# Altium project Marsault1.PrjPcb (part 2 of 7)

## Sheet POWER.SchDoc
size A3; SheetNumber: 2; SheetTotal: 9
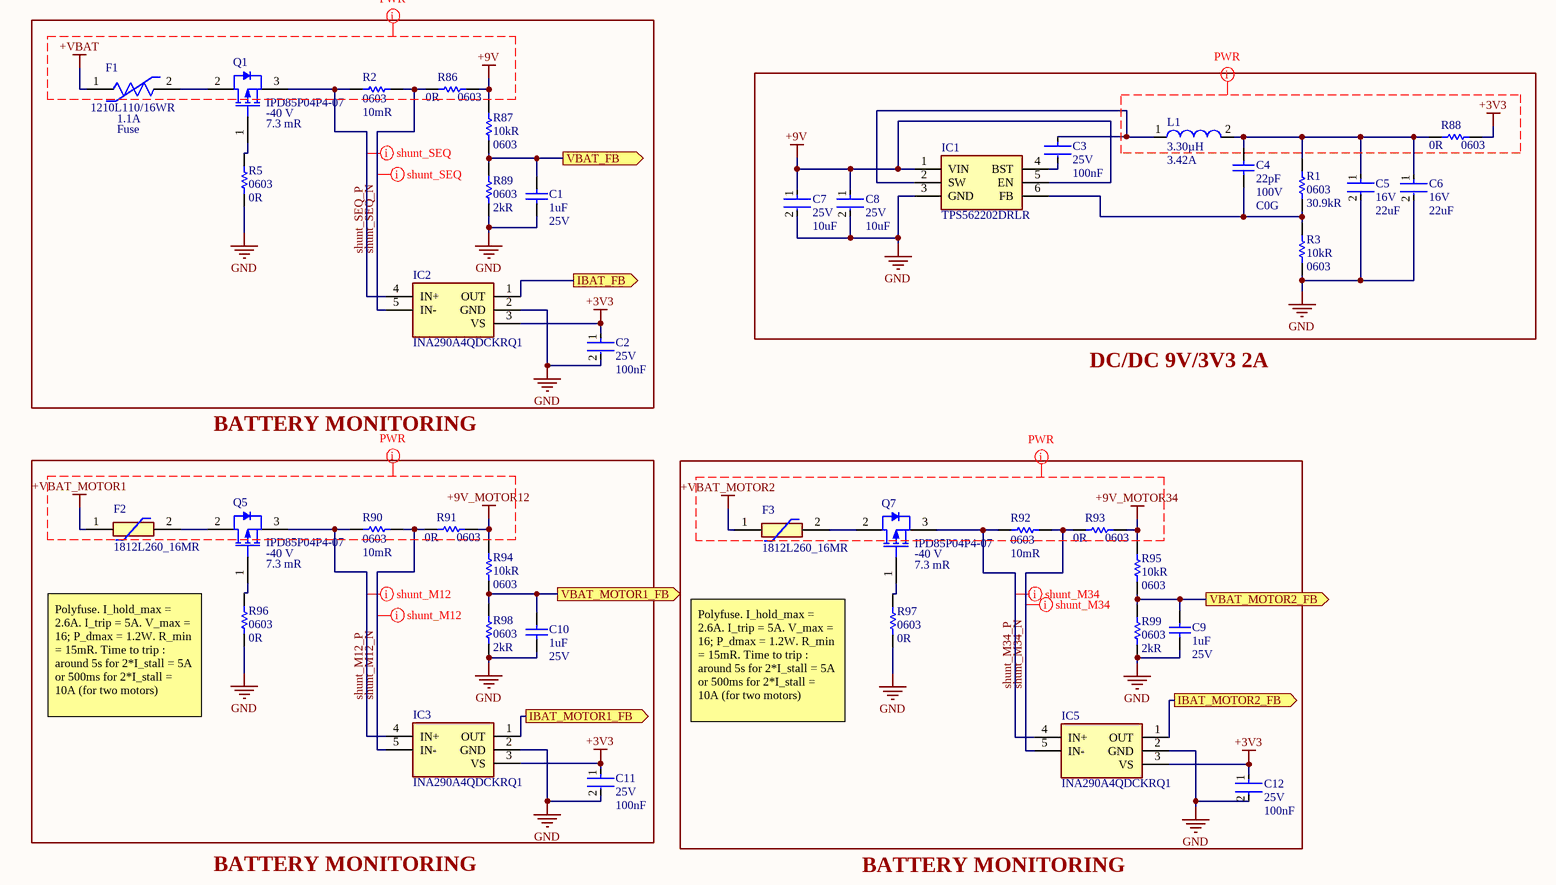
[diagram p1: POWER.SchDoc]

### Parts
C1  Capacitance: 1uF  Voltage Rating (DC): 25V  [CAPC1608X90X35LL15T15]  (hidden comment: C0603C105K3PAC7867)
C2  Voltage Rating (DC): 25V  Capacitance: 100nF  [FP-CGA3E-0_3-0_1-MFG]  (hidden comment: CGA3E2X7R1E104K080AA)
C3  Voltage Rating (DC): 25V  Capacitance: 100nF  [FP-CGA3E-0_3-0_1-MFG]  (hidden comment: CGA3E2X7R1E104K080AA)
C4  Capacitance: 22pF  Voltage Rating (DC): 100V  Dielectric: C0G  [CAPC1608X90X35NL10T15]  (hidden comment: GRM1885C2A220JA01D)
C5  Voltage Rating: 16V  Capacitance: 22uF  [FP-C2012-125-MFG]  (hidden comment: C2012X5R1C226K125AC)
C6  Voltage Rating: 16V  Capacitance: 22uF  [FP-C2012-125-MFG]  (hidden comment: C2012X5R1C226K125AC)
C7  Voltage Rating (DC): 25V  Capacitance: 10uF  [FP-C2012-125-0_2-IPC_B]  (hidden comment: C2012X5R1E106K125AB)
C8  Voltage Rating (DC): 25V  Capacitance: 10uF  [FP-C2012-125-0_2-IPC_B]  (hidden comment: C2012X5R1E106K125AB)
C9  Capacitance: 1uF  Voltage Rating (DC): 25V  [CAPC1608X90X35LL15T15]  (hidden comment: C0603C105K3PAC7867)
C10  Capacitance: 1uF  Voltage Rating (DC): 25V  [CAPC1608X90X35LL15T15]  (hidden comment: C0603C105K3PAC7867)
C11  Voltage Rating (DC): 25V  Capacitance: 100nF  [FP-CGA3E-0_3-0_1-MFG]  (hidden comment: CGA3E2X7R1E104K080AA)
C12  Voltage Rating (DC): 25V  Capacitance: 100nF  [FP-CGA3E-0_3-0_1-MFG]  (hidden comment: CGA3E2X7R1E104K080AA)
F1  1210L110/16WR  Hold Current: 1.1A  Category: Fuse  [FP-1210L110-16WR-MFG]
F2  1812L260_16MR  [1812L010DR]
F3  1812L260_16MR  [1812L010DR]
IC1  TPS562202DRLR  [SOTFL50P160X60-6N]
IC2  INA290A4QDCKRQ1  [SOT65P210X110-5N]
IC3  INA290A4QDCKRQ1  [SOT65P210X110-5N]
IC5  INA290A4QDCKRQ1  [SOT65P210X110-5N]
L1  Inductance: 3.30µH  Current Rating: 3.42A  [WE-PD-S-PB]  (hidden comment: 7447789003)
Q1  IPD85P04P4-07  VDS (max): -40 V  RDS (on) (max) (@10V): 7.3 mR  [INF-PG-TO252-3-313_L]
Q5  IPD85P04P4-07  VDS (max): -40 V  RDS (on) (max) (@10V): 7.3 mR  [INF-PG-TO252-3-313_L]
Q7  IPD85P04P4-07  VDS (max): -40 V  RDS (on) (max) (@10V): 7.3 mR  [INF-PG-TO252-3-313_L]
R1  Case Code (Imperial): 0603  Resistance: 30.9kR  [RESC1608X55X25NL10T15]  (hidden comment: RC0603FR-0730K9L)
R2  Case Code (Imperial): 0603  Resistance: 10mR  [RESC1508X46X38ML25T25]  (hidden comment: WSL0603R0100FEA)
R3  Resistance: 10kR  Case Code (Imperial): 0603  [RESC1609X55X30LL15T15]  (hidden comment: ERJ3EKF1002V)
R5  Case Code (Imperial): 0603  Resistance: 0R  [RESC1608X55X25ML10T15]  (hidden comment: RC0603JR-070RL)
R86  Case Code (Imperial): 0603  Resistance: 0R  [RESC1608X55X25ML10T15]  (hidden comment: RC0603JR-070RL)
R87  Resistance: 10kR  Case Code (Imperial): 0603  [RESC1609X55X30LL15T15]  (hidden comment: ERJ3EKF1002V)
R88  Case Code (Imperial): 0603  Resistance: 0R  [RESC1608X55X25ML10T15]  (hidden comment: RC0603JR-070RL)
R89  Case Code (Imperial): 0603  Resistance: 2kR  [RESC1608X55X30ML15T15]  (hidden comment: ERJ-3EKF2001V)
R90  Case Code (Imperial): 0603  Resistance: 10mR  [RESC1508X46X38ML25T25]  (hidden comment: WSL0603R0100FEA)
R91  Case Code (Imperial): 0603  Resistance: 0R  [RESC1608X55X25ML10T15]  (hidden comment: RC0603JR-070RL)
R92  Case Code (Imperial): 0603  Resistance: 10mR  [RESC1508X46X38ML25T25]  (hidden comment: WSL0603R0100FEA)
R93  Case Code (Imperial): 0603  Resistance: 0R  [RESC1608X55X25ML10T15]  (hidden comment: RC0603JR-070RL)
R94  Resistance: 10kR  Case Code (Imperial): 0603  [RESC1609X55X30LL15T15]  (hidden comment: ERJ3EKF1002V)
R95  Resistance: 10kR  Case Code (Imperial): 0603  [RESC1609X55X30LL15T15]  (hidden comment: ERJ3EKF1002V)
R96  Case Code (Imperial): 0603  Resistance: 0R  [RESC1608X55X25ML10T15]  (hidden comment: RC0603JR-070RL)
R97  Case Code (Imperial): 0603  Resistance: 0R  [RESC1608X55X25ML10T15]  (hidden comment: RC0603JR-070RL)
R98  Case Code (Imperial): 0603  Resistance: 2kR  [RESC1608X55X30ML15T15]  (hidden comment: ERJ-3EKF2001V)
R99  Case Code (Imperial): 0603  Resistance: 2kR  [RESC1608X55X30ML15T15]  (hidden comment: ERJ-3EKF2001V)

### Ports
IBAT_FB (out), IBAT_MOTOR1_FB (out), IBAT_MOTOR2_FB (out), VBAT_FB (out), VBAT_MOTOR1_FB (out), VBAT_MOTOR2_FB (out)

### Nets
+3V3: C2.1 C11.1 C12.1 IC2.3(VS) IC3.3(VS) IC5.3(VS) R88.2
+9V: C7.1 C8.1 IC1.1(VIN) IC1.5(EN) R86.2 R87.2
+9V_MOTOR12: R91.2 R94.2  [project net VCC_PWR]
+9V_MOTOR34: R93.2 R95.2  [project net VCC_PWR]
+VBAT: F1.1
+VBAT_MOTOR1: F2.1
+VBAT_MOTOR2: F3.1
GND: C1.1 C2.2 C5.2 C6.2 C7.2 C8.2 C9.1 C10.1 C11.2 C12.2 IC1.3(GND) IC2.2(GND) IC3.2(GND) IC5.2(GND) R3.1 R5.1 R89.1 R96.1 R97.1 R98.1 R99.1
IBAT_FB: IC2.1(OUT) ; port IBAT_FB
IBAT_MOTOR1_FB: IC3.1(OUT) ; port IBAT_MOTOR1_FB
IBAT_MOTOR2_FB: IC5.1(OUT) ; port IBAT_MOTOR2_FB
shunt_M12_N: IC3.5(IN-) R90.2 R91.1
shunt_M12_P: IC3.4(IN+) Q5.3(SOURCE) R90.1
shunt_M34_N: IC5.5(IN-) R92.2 R93.1
shunt_M34_P: IC5.4(IN+) Q7.3(SOURCE) R92.1
shunt_SEQ_N: IC2.5(IN-) R2.2 R86.1
shunt_SEQ_P: IC2.4(IN+) Q1.3(SOURCE) R2.1
VBAT_FB: C1.2 R87.1 R89.2 ; port VBAT_FB
VBAT_MOTOR1_FB: C10.2 R94.1 R98.2 ; port VBAT_MOTOR1_FB
VBAT_MOTOR2_FB: C9.2 R95.1 R99.2 ; port VBAT_MOTOR2_FB
NetC3_1: C3.1 IC1.2(SW) L1.1
NetC3_2: C3.2 IC1.4(BST)
NetC4_1: C4.1 IC1.6(FB) R1.1 R3.2
NetC4_2: C4.2 C5.1 C6.1 L1.2 R1.2 R88.1
NetF1_2: F1.2 Q1.2(DRAIN)
NetF2_2: F2.2 Q5.2(DRAIN)
NetF3_2: F3.2 Q7.2(DRAIN)
NetQ1_1: Q1.1(GATE) R5.2
NetQ5_1: Q5.1(GATE) R96.2
NetQ7_1: Q7.1(GATE) R97.2

### Layout directives
net class PWR: +3V3, +9V, +9V_MOTOR12, +9V_MOTOR34, +VBAT, +VBAT_MOTOR1, +VBAT_MOTOR2
differential pair; differential pair class shunt_M12: shunt_M12_N, shunt_M12_P
differential pair; differential pair class shunt_SEQ: shunt_SEQ_N, shunt_SEQ_P
differential pair; differential pair class shunt_M34: shunt_M34_N, shunt_M34_P

### Notes on the sheet
- DC/DC 9V/3V3 2A
- BATTERY MONITORING
- Polyfuse. I_hold_max = 2.6A. I_trip = 5A. V_max = 16; P_dmax = 1.2W. R_min = 15mR. Time to trip : around 5s for 2*I_stall = 5A or 500ms for 2*I_stall = 10A (for two motors)

### Library data of the parts
C1 C9 C10 = CMP-2006-02216-2: Manufacturer: Kemet; Manufacturer Part Number: C0603C105K3PACTU; Dielectric Material: Ceramic; Tolerance: 10%; Dielectric: X5R; Part Number: C0603C105K3PAC7867; Supplier 1: Mouser; Supplier Part Number 1: 80-C0603C105K3P; RoHS: Yes; Category: Ceramic Capacitors; Stock 1: 10085; Pricing 1: 1=0,30000, 10=0,15600, 50=0,15600, 100=0,09300, 500=0,08200, 1000=0,07300, 4000=0,05700, 10000=0,05700 (USD); Mount: Surface Mount,PCB; Case/Package: 0603; Number of Pins: 2; Case Code (Imperial): 0603; Case Code (Metric): 1608; Contact Plating: Tin,Matte; Min Operating Temperature: -55°C; Max Operating Temperature: 85°C; Packaging: Tape and Reel; Termination: SMD/SMT; Voltage Rating: 25V; Package Quantity: 4000; Voltage: 25V; Series: C0603C; Construction: Flat; Length: 1.6mm; Width: 0.031inch; Height: 0.8mm; Depth: 0.8mm; Thickness: 0.034inch; Radiation Hardening: No; REACH SVHC: No SVHC; RoHS Compliant: Yes; Lead Free: Lead Free; ComponentLink1URL: https://datasheet.ciiva.com/5998/40889-5998745.pdf?src-supplier=Farnell; ComponentLink1Description: https://datasheet.ciiva.com/5998/40889-5998745.pdf?src-supplier=Farnell; ComponentLink2URL: https://datasheet.ciiva.com/28610/1918694-28610792.pdf?src-supplier=Element14; ComponentLink2Description: https://datasheet.ciiva.com/28610/1918694-28610792.pdf?src-supplier=Element14
C2 C3 C11 C12 = CMP-08246-002186-1: Cap Ceramic 100nF 25V X7R 10% Pad SMD 0603 +125°C Automotive T/R; Manufacturer: TDK; Composition: Ceramic; Dielectric: X7R; Ratings: AEC-Q200; Length: 1.6mm; REACH SVHC: No SVHC; Width: 0.031inch; Packaging: Tape and Reel; Case/Package: 0603; Height: 0.8mm; Termination: SMD/SMT; Max Operating Temperature: 125°C; Thickness: 0.035inch; Case Code (Metric): 1608; Lead Free: Lead Free; Mount: Surface Mount; Voltage Rating: 25V; Tolerance: 10%; Weight: 7.1E-05oz; Min Operating Temperature: -55°C; Package Quantity: 1; Depth: 0.8mm; Case Code (Imperial): 0603; Supplier 1: Mouser; Supplier Part Number 1: 810-CGA3E2X7R1E104K; Manufacturer Part Number: CGA3E2X7R1E104K080AA; RoHS: Yes; Category: Ceramic Capacitors; Stock 1: 488891; Pricing 1: 1=0,12000, 10=0,05600, 50=0,05600, 100=0,02500, 1000=0,01400, 10000=0,01000 (USD); Series: CGA; Resistor Type: Ceramic; RoHS Compliant: Yes; ComponentLink1URL: https://datasheet.ciiva.com/24220/cga3e2x7r1e104k080aa-265934-24220022.pdf?src-supplier=Mouser; ComponentLink1Description: https://datasheet.ciiva.com/24220/cga3e2x7r1e104k080aa-265934-24220022.pdf?src-supplier=Mouser; ComponentLink2URL: https://datasheet.ciiva.com/22725/1735392-22725638.pdf?src-supplier=Element14; ComponentLink2Description: https://datasheet.ciiva.com/22725/1735392-22725638.pdf?src-supplier=Element14; ComponentLink3URL: https://datasheet.ciiva.com/22725/1735392-22725639.pdf?src-supplier=Element14; ComponentLink3Description: https://datasheet.ciiva.com/22725/1735392-22725639.pdf?src-supplier=Element14; ComponentLink4URL: https://datasheet.ciiva.com/16427/mlccspec-automotive-general-midvoltage-en-16427320.pdf?src-supplier=Future+Electronics; ComponentLink4Description: https://datasheet.ciiva.com/16427/mlccspec-automotive-general-midvoltage-en-16427320.pdf?src-supplier=Future+Electronics; ComponentLink5URL: https://datasheet.ciiva.com/23803/1735392-23803082.pdf?src-supplier=Newark; ComponentLink5Description: https://datasheet.ciiva.com/23803/1735392-23803082.pdf?src-supplier=Newark
C4 = CMP-2006-02720-1: Manufacturer: Murata; Material: Ceramic; Tolerance: 5%; Temperature Coefficient: 30ppm/°C; Part Number: GRM1885C2A220JA01D; Supplier 1: Mouser; Supplier Part Number 1: 81-GRM1885C2A220JA01; Manufacturer Part Number: GRM1885C2A220JA01D; RoHS: Yes; Category: Ceramic Capacitors; Stock 1: 57112; Pricing 1: 1=0,12000, 10=0,07500, 50=0,07500, 100=0,03600, 1000=0,02100, 10000=0,01600 (USD); Mount: Surface Mount; Case/Package: 0603; Case Code (Metric): 1608; Case Code (Imperial): 0603; Min Operating Temperature: -55°C; Max Operating Temperature: 125°C; Packaging: Tape and Reel; Package Quantity: 1; Voltage Rating: 100V; Series: GRM; Termination: SMD/SMT; Voltage: 100V; Construction: Flat; Length: 1.6mm; Width: 0.031inch; Height: 0.8mm; Depth: 0.8mm; Thickness: 0.035inch; Size: 0.8mm; Radiation Hardening: No; Lead Free: Lead Free; RoHS Compliant: Yes; REACH SVHC: No SVHC; ComponentLink1URL: https://datasheet.ciiva.com/16337/product-16337138.pdf?src-supplier=Future+Electronics; ComponentLink1Description: https://datasheet.ciiva.com/16337/product-16337138.pdf?src-supplier=Future+Electronics; ComponentLink2URL: https://datasheet.ciiva.com/11789/0900766b80ef921d-11789140.pdf?src-supplier=RSComponents; ComponentLink2Description: https://datasheet.ciiva.com/11789/0900766b80ef921d-11789140.pdf?src-supplier=RSComponents; ComponentLink3URL: https://datasheet.ciiva.com/19475/1857209-19475865.pdf?src-supplier=Jameco; ComponentLink3Description: https://datasheet.ciiva.com/19475/1857209-19475865.pdf?src-supplier=Jameco; ComponentLink4URL: https://datasheet.ciiva.com/29202/451275-da-01-en-vs-kondensator-0603-29202363.pdf?src-supplier=Conrad; ComponentLink4Description: https://datasheet.ciiva.com/29202/451275-da-01-en-vs-kondensator-0603-29202363.pdf?src-supplier=Conrad; ComponentLink5URL: https://datasheet.ciiva.com/132/partnumbering-e-01-132301.pdf?src-supplier=Digi-Key; ComponentLink5Description: https://datasheet.ciiva.com/132/partnumbering-e-01-132301.pdf?src-supplier=Digi-Key; ComponentLink6URL: https://datasheet.ciiva.com/132/partnumbering-e-01-132302.pdf?src-supplier=Digi-Key; ComponentLink6Description: https://datasheet.ciiva.com/132/partnumbering-e-01-132302.pdf?src-supplier=Digi-Key; ComponentLink7URL: https://datasheet.ciiva.com/132/partnumbering-e-01-132303.pdf?src-supplier=Digi-Key; ComponentLink7Description: https://datasheet.ciiva.com/132/partnumbering-e-01-132303.pdf?src-supplier=Digi-Key
C5 C6 = CMP-2000-06037-2: CAP CER 22UF 16V X5R 0805; Manufacturer: TDK; Tolerance: 10%; Material: Ceramic; Temperature Coefficient: 15%; Octopart: https://octopart.com/c2012x5r1c226k125ac-tdk-25947713; ComponentLink2Description: Datasheet; Category: Cap; Temperature: -55°C to +85°C; Device Class L3: Ceramic Capacitors; ComponentLink2URL: https://product.tdk.com/info/en/catalog/datasheets/mlcc_commercial_general_en.pdf; Lead Free: Yes; Voltage: 16V; Temperature Range High: +85°C; Temperature Range Low: -55°C; Package: C2012-125; RoHS: TRUE; Temperature Characteristic: X5R; Value: 22uF; Height: 1.45mm; Digikey Description: CAP CER 22UF 16V X5R 0805; Manufacturer Part Number: C2012X5R1C226K125AC; Device Class L1: Passive Components; Device Class L2: Capacitors; Footprint Url: https://product.tdk.com/info/en/catalog/spec/mlccspec_commercial_general_midvoltage_en.pdf; Ipc Land Pattern Name: CAPC200125X125; Automotive: No; Supplier 1: Mouser; Supplier Part Number 1: 810-C2012X5R1C226K; Stock 1: 110317; Pricing 1: 1=0,73000, 10=0,49600, 50=0,49600, 100=0,34200, 1000=0,23700, 10000=0,22000 (USD); Mount: Surface Mount; Case/Package: 0805; Number of Pins: 2; Case Code (Metric): 2012; Case Code (Imperial): 0805; Weight: 0.000194oz; Dielectric Material: Ceramic; Min Operating Temperature: -55°C; Max Operating Temperature: 85°C; Packaging: Tape and Reel; Voltage Rating (DC): 16V; Package Quantity: 1; Dielectric: X5R; Termination: Wraparound; Resistor Type: Ceramic; Series: C; Construction: Flat; Length: 2mm; Width: 0.049inch; Thickness: 0.057inch; Depth: 1.25mm; RoHS Compliant: Yes; REACH SVHC: No SVHC; ComponentLink1URL: https://datasheet.ciiva.com/24399/prc2012x5r-24399250.pdf?src-supplier=Onlinecomponents.com; ComponentLink1Description: https://datasheet.ciiva.com/24399/prc2012x5r-24399250.pdf?src-supplier=Onlinecomponents.com; ComponentLink3URL: https://datasheet.ciiva.com/6286/tdkmlcccaprange-6286857.pdf?src-supplier=Digi-Key; ComponentLink3Description: https://datasheet.ciiva.com/6286/tdkmlcccaprange-6286857.pdf?src-supplier=Digi-Key; ComponentLink4URL: https://datasheet.ciiva.com/6286/tdkmlcccaprange-6286859.pdf?src-supplier=Digi-Key; ComponentLink4Description: https://datasheet.ciiva.com/6286/tdkmlcccaprange-6286859.pdf?src-supplier=Digi-Key; ComponentLink5URL: https://datasheet.ciiva.com/6286/tdkmlcccaprange-6286860.pdf?src-supplier=Digi-Key; ComponentLink5Description: https://datasheet.ciiva.com/6286/tdkmlcccaprange-6286860.pdf?src-supplier=Digi-Key; ComponentLink6URL: https://datasheet.ciiva.com/48671/mlcc-commercial-general-en-48671373.pdf?src-supplier=Avnet; ComponentLink6Description: https://datasheet.ciiva.com/48671/mlcc-commercial-general-en-48671373.pdf?src-supplier=Avnet; ComponentLink7URL: https://datasheet.ciiva.com/22719/1796654-22719550.pdf?src-supplier=Element14; ComponentLink7Description: https://datasheet.ciiva.com/22719/1796654-22719550.pdf?src-supplier=Element14; ComponentLink8URL: https://datasheet.ciiva.com/23803/1796654-23803023.pdf?src-supplier=Newark; ComponentLink8Description: https://datasheet.ciiva.com/23803/1796654-23803023.pdf?src-supplier=Newark
C7 C8 = CMP-08246-002675-1: Multilayer Ceramic Capacitors 10μF ±10% 25V X5R SMD 0805; Manufacturer: TDK; Packaging: Tape and Reel; Dielectric: X5R; Case/Package: 0805; Lead Free: Lead Free; Dielectric Material: Ceramic; Series: C; Termination: SMD/SMT; Voltage: 25V; Depth: 1.25mm; Max Operating Temperature: 85°C; Resistor Type: Ceramic; Weight: 0.000194oz; Case Code (Metric): 2012; Height: 1.25mm; Mount: Surface Mount; Voltage Rating: 25V; Length: 2mm; REACH SVHC: No SVHC; Min Operating Temperature: -55°C; Case Code (Imperial): 0805; Thickness: 0.057inch; Width: 0.049inch; Tolerance: 10%; Package Quantity: 1; Supplier 1: Mouser; Supplier Part Number 1: 810-C2012X5R1E106K; Manufacturer Part Number: C2012X5R1E106K125AB; RoHS: Yes; Category: Ceramic Capacitors; Stock 1: 75897; Pricing 1: 1=0,34000, 10=0,24100, 50=0,24100, 100=0,14400, 1000=0,09100, 10000=0,08800 (USD); ComponentLink1URL: https://datasheet.ciiva.com/22725/1913358-22725561.pdf?src-supplier=Element14; ComponentLink1Description: https://datasheet.ciiva.com/22725/1913358-22725561.pdf?src-supplier=Element14; ComponentLink2URL: https://datasheet.ciiva.com/16394/general-b11-16394044.pdf?src-supplier=Future+Electronics; ComponentLink2Description: https://datasheet.ciiva.com/16394/general-b11-16394044.pdf?src-supplier=Future+Electronics; ComponentLink3URL: https://datasheet.ciiva.com/24216/mlcc-commercial-general-en-24216237.pdf?src-supplier=Mouser; ComponentLink3Description: https://datasheet.ciiva.com/24216/mlcc-commercial-general-en-24216237.pdf?src-supplier=Mouser
F1 = CMP-08606-000029-1: PTC RESET FUSE 16V 1.1A 1210; Manufacturer: Littelfuse Inc; Trip Time: 0.1s; Value: 0.06-0.21Ω; Trip Current: 2.2A; Current Rating: 100A; Ambient Temperature Range Low: -40°C; Voltage Rating: 16V; ComponentLink2URL: https://www.littelfuse.com/~/media/electronics/datasheets/resettable_ptcs/littelfuse_ptc_1210l_datasheet.pdf.pdf; Device Class L2: PTC Resettable Fuses; Automotive: No; Temperature: -40°C to +85°C; Mouser Description: Resettable Fuses - PPTC 16V 1.10A 1210 PTC; Temperature Range High: +85°C; Manufacturer Part Number: 1210L110/16WR; Temperature Range Low: -40°C; Device Class L1: Circuit Protection; Octopart: https://octopart.com/1210l110%2F16wr-littelfuse-28867107; Lead Free: Yes; Resistance: 0.06-0.21Ω; RoHS: TRUE; Digikey Description: PTC RESET FUSE 16V 1.1A 1210; Package: 0; Height: 1.25mm; Device Class L3: unset; ComponentLink2Description: Datasheet; Ambient Temperature Range High: +85°C
F2 F3 = 1812L260_16MR: Resettable Fuse; Manufacturer_Name: LITTELFUSE; Manufacturer_Part_Number: 1812L260/16MR; Datasheet Link: http://www.littelfuse.com/~/media/electronics/datasheets/resettable_ptcs/littelfuse_ptc_1812l_datasheet.pdf.pdf; Height: 1.25mm; Mouser Part Number: 576-1812L260/16MR; Mouser Price/Stock: https://www.mouser.co.uk/ProductDetail/Littelfuse/1812L260-16MR?qs=cIziFXvMxOVeszNO%252BSt%252B3Q%3D%3D; Arrow Part Number: 1812L260/16MR; Arrow Price/Stock: https://www.arrow.com/en/products/1812l26016mr/littelfuse
IC1 = TPS562202DRLR: Integrated Circuit; Manufacturer_Name: Texas Instruments; Datasheet Link: https://www.ti.com/lit/ds/symlink/tps562202.pdf?ts=1604777108449&ref_url=https%253A%252F%252Fwww.mouser.com%252F; Height: 0.6mm; Manufacturer_Part_Number: TPS562202DRLR; Mouser Part Number: 595-TPS562202DRLR; Mouser Price/Stock: https://www.mouser.co.uk/ProductDetail/Texas-Instruments/TPS562202DRLR?qs=zW32dvEIR3tsfor3m0Zzkw%3D%3D; Arrow Part Number: TPS562202DRLR; Arrow Price/Stock: https://www.arrow.com/en/products/tps562202drlr/texas-instruments
IC2 IC3 IC5 = INA290A4QDCKRQ1: Integrated Circuit; Manufacturer_Name: Texas Instruments; Datasheet Link: https://www.ti.com/lit/gpn/INA290-Q1; Height: 1.1mm; Manufacturer_Part_Number: INA290A4QDCKRQ1; Mouser Part Number: 595-INA290A4QDCKRQ1; Mouser Price/Stock: https://www.mouser.co.uk/ProductDetail/Texas-Instruments/INA290A4QDCKRQ1?qs=eP2BKZSCXI5u8rewO66qig%3D%3D; Arrow Part Number: INA290A4QDCKRQ1; Arrow Price/Stock: https://www.arrow.com/en/products/ina290a4qdckrq1/texas-instruments?region=nac
L1 = CMP-1396-00044-1: SMD-Shielded Power Inductor WE-PD, L=3.30 µH; Manufacturer: Wuerth Elektronik; Core Material: Ferrite; Tolerance: 20%; DC Resistance (DCR): 30mR; Test Frequency: 1kHz; Self Resonant Frequency: 33MHz; Saturation Current: 4.2A; PackageDescription: SMD Inductor, 2-Leads, Body 7.3 x 7.3 mm; ComponentLink1URL: http://www.we-online.com; PackageReference: WE-PD-S-PB; PartNumber: 7447789003; ComponentLink2Description: Datasheet; ComponentLink1Description: Manufacturer URL; ComponentLink2URL: http://www.we-online.de/katalog/media/pdf/7447789003.pdf; Supplier 1: Mouser; Supplier Part Number 1: 710-7447789003; Manufacturer Part Number: 7447789003; RoHS: Yes; Category: Fixed Inductors; Stock 1: 4608; Pricing 1: 1=2,44000, 10=2,18000, 50=2,02000, 100=1,95000, 500=1,87000, 1000=1,60000, 10000=1,60000 (USD); Mount: Surface Mount; Case/Package: Nonstandard; Min Operating Temperature: -40°C; Max Operating Temperature: 125°C; Shielding: Shielded; Packaging: Tape and Reel; Package Quantity: 1000; Max DC Current: 3.42A; Termination: SMD/SMT; Series: WE-PD; Inductance Tolerance: 20%; Resistor Type: Wirewound; RMS Current (Irms): 3.42A; Series Resistance: 30mR; Resistance: 30mR; Length: 7.3mm; Width: 7.3mm; Height: 3.2mm; Height - Seated (Max): 0.138inch; RoHS Compliant: Yes; REACH SVHC: Unknown; Lead Free: Lead Free; ComponentLink3URL: https://datasheet.ciiva.com/4954/7447789003-86479-4954512.pdf?src-supplier=Mouser; ComponentLink3Description: https://datasheet.ciiva.com/4954/7447789003-86479-4954512.pdf?src-supplier=Mouser; ComponentLink4URL: https://datasheet.ciiva.com/7754/1736485-7754691.pdf?src-supplier=Element14; ComponentLink4Description: https://datasheet.ciiva.com/7754/1736485-7754691.pdf?src-supplier=Element14; ComponentLink5URL: https://datasheet.ciiva.com/7354/7447789003-7354724.pdf?src-supplier=Newark; ComponentLink5Description: https://datasheet.ciiva.com/7354/7447789003-7354724.pdf?src-supplier=Newark; ComponentLink6URL: https://datasheet.ciiva.com/1051/7447789003-1051291.pdf?src-supplier=Digi-Key; ComponentLink6Description: https://datasheet.ciiva.com/1051/7447789003-1051291.pdf?src-supplier=Digi-Key; ComponentLink7URL: https://datasheet.ciiva.com/1051/7447789003-1051292.pdf?src-supplier=Digi-Key; ComponentLink7Description: https://datasheet.ciiva.com/1051/7447789003-1051292.pdf?src-supplier=Digi-Key
Q1 Q5 Q7 = CMP-1138-00157-1: OptiMOS-P2 Power-Transistor, -40 V VDS, -85 A ID, PG-TO252-3-313, Reel, Green; Manufacturer: Infineon; Ptot (max): 88 W; RthJC (max): 1.7 K/W; VGS(th) (max): -4 V; IDpuls (max): -340 A; VGS(th) (min): -2 V; ID (max): -85 A; QG: 69 nC; Green: TRUE; PartNumber: IPD85P04P4-07; Mounting Technology: Surface Mount; Technology: OptiMOS-P2; ComponentLink1URL: http://www.infineon.com/; DatasheetVersion: Rev. 1.0; PackageReference: PG-TO252-3-313; ComponentLink2Description: Datasheet; ComponentLink2URL: http://www.infineon.com/dgdl/IPD85P04P4-07_DS_10.pdf?folderId=db3a304412b407950112b42b75b74520&fileId=db3a30432f69f146012f782666e92ddd&location=en.Products.Automotive_ICs.Automotive_MOSFETs.Single__P-Channel_40V_MOSFETs.DATASHEET.IPD85P04P4-07_DS_10.pdf; Halogen-free: TRUE; ComponentLink3Description: Package Specification; Packing: Reel; PackageVersion: Oct-10; PackageDescription: 3-Pin Plastic (Green) Transistor Single Outline Package, 6.5 x 6.12 mm Body, 2.28 mm Pitch; ComponentLink3URL: http://www.infineon.com/dgdl/PG-TO252-3-313-Package_Overview.pdf?folderId=db3a30432b57a660012b81890ade72d2&fileId=db3a30432b57a660012b8193af2872eb; ComponentLink1Description: Manufacturer URL
R1 = CMP-2000-04004-1: Manufacturer: Yageo; Tolerance: 1%; Power Rating: 100mW; Voltage Rating: 50V; Temperature Coefficient: 100ppm/°C; Part Number: RC0603FR-0730K9L; Supplier 1: Mouser; Supplier Part Number 1: 603-RC0603FR-0730K9L; Manufacturer Part Number: RC0603FR-0730K9L; RoHS: Yes; Category: Chip SMD Resistors; Stock 1: 6591; Pricing 1: 1=0,10000, 10=0,02400, 50=0,02400, 100=0,01000, 1000=0,00400, 10000=0,00300 (USD); Case/Package: 0603; Case Code (Metric): 1608; Size Code: 0603; Min Operating Temperature: -55°C; Max Operating Temperature: 155°C; Package Quantity: 1; Packaging: Tape and Reel; Resistor Type: Thick Film; Number of Terminations: 2; Max Power Dissipation: 100mW; Voltage Rating (DC): 50V; Series: RC; Termination: SMD/SMT; Construction: Rectangular; Features: Moisture Resistant; Length: 1.6mm; Width: 0.031inch; Height: 0.022inch; Depth: 0.8mm; RoHS Compliant: Yes; Lead Free: Lead Free; Military Standard: Not; ComponentLink1URL: https://datasheet.ciiva.com/2453/pyu-r-int-thick-7-2453976.pdf?src-supplier=Digi-Key; ComponentLink1Description: https://datasheet.ciiva.com/2453/pyu-r-int-thick-7-2453976.pdf?src-supplier=Digi-Key; ComponentLink2URL: https://datasheet.ciiva.com/2453/pyu-r-int-thick-7-2453977.pdf?src-supplier=Digi-Key; ComponentLink2Description: https://datasheet.ciiva.com/2453/pyu-r-int-thick-7-2453977.pdf?src-supplier=Digi-Key; ComponentLink3URL: https://datasheet.ciiva.com/2453/pyu-r-int-thick-7-2453978.pdf?src-supplier=Digi-Key; ComponentLink3Description: https://datasheet.ciiva.com/2453/pyu-r-int-thick-7-2453978.pdf?src-supplier=Digi-Key
R2 R90 R92 = CMP-2000-03799-1: Manufacturer: Vishay Dale; Tolerance: 1%; Temperature Coefficient: 75ppm/°C; Power Rating: 100mW; Part Number: WSL0603R0100FEA; Supplier 1: Mouser; Supplier Part Number 1: 71-WSL0603R0100FEA; Manufacturer Part Number: WSL0603R0100FEA; RoHS: No; Category: Chip SMD Resistors; Stock 1: 418; Pricing 1: 1=1,03000, 10=0,76500, 50=0,76500, 100=0,47100, 1000=0,39000, 5000=0,37200, 10000=0,37200 (USD); Case/Package: 0603; Number of Pins: 2; Case Code (Metric): 1608; Weight: 7.1E-05oz; Contact Plating: Tin,Matte; Min Operating Temperature: -65°C; Max Operating Temperature: 170°C; Packaging: Tape and Reel; Resistor Type: Metal Element,Metal Strip; Package Quantity: 1; Number of Terminations: 2; Termination: SMD/SMT; Max Power Dissipation: 100mW; Features: Moisture Resistant; Length: 0.06inch; Width: 0.03inch; Height: 0.33mm; Depth: 0.76mm; Radiation Hardening: No; Lead Free: Lead Free; REACH SVHC: Unknown; ComponentLink1URL: https://datasheet.ciiva.com/7791/1598296-7791987.pdf?src-supplier=Element14; ComponentLink1Description: https://datasheet.ciiva.com/7791/1598296-7791987.pdf?src-supplier=Element14; ComponentLink2URL: https://datasheet.ciiva.com/2482/wsl-2482914.pdf?src-supplier=Digi-Key; ComponentLink2Description: https://datasheet.ciiva.com/2482/wsl-2482914.pdf?src-supplier=Digi-Key; ComponentLink3URL: https://datasheet.ciiva.com/2482/wsl-2482915.pdf?src-supplier=Digi-Key; ComponentLink3Description: https://datasheet.ciiva.com/2482/wsl-2482915.pdf?src-supplier=Digi-Key; ComponentLink4URL: https://datasheet.ciiva.com/2482/wsl-2482916.pdf?src-supplier=Digi-Key; ComponentLink4Description: https://datasheet.ciiva.com/2482/wsl-2482916.pdf?src-supplier=Digi-Key; ComponentLink5URL: https://datasheet.ciiva.com/9049/wsl-9049413.pdf?src-supplier=Avnet; ComponentLink5Description: https://datasheet.ciiva.com/9049/wsl-9049413.pdf?src-supplier=Avnet; ComponentLink6URL: https://datasheet.ciiva.com/5469/wsl-101914-5469241.pdf?src-supplier=Mouser; ComponentLink6Description: https://datasheet.ciiva.com/5469/wsl-101914-5469241.pdf?src-supplier=Mouser; ComponentLink7URL: https://datasheet.ciiva.com/17189/wsl-17189978.pdf?src-supplier=Avnet+Europe; ComponentLink7Description: https://datasheet.ciiva.com/17189/wsl-17189978.pdf?src-supplier=Avnet+Europe; ComponentLink8URL: https://datasheet.ciiva.com/28621/1911169-28621724.pdf?src-supplier=Element14; ComponentLink8Description: https://datasheet.ciiva.com/28621/1911169-28621724.pdf?src-supplier=Element14; ComponentLink9URL: https://datasheet.ciiva.com/16510/wsl-16510141.pdf?src-supplier=Future+Electronics; ComponentLink9Description: https://datasheet.ciiva.com/16510/wsl-16510141.pdf?src-supplier=Future+Electronics; ComponentLink10URL: https://datasheet.ciiva.com/28621/1911169-28621725.pdf?src-supplier=Element14; ComponentLink10Description: https://datasheet.ciiva.com/28621/1911169-28621725.pdf?src-supplier=Element14; ComponentLink11URL: https://datasheet.ciiva.com/16755/70205438-16755071.pdf?src-supplier=Allied+Electronics; ComponentLink11Description: https://datasheet.ciiva.com/16755/70205438-16755071.pdf?src-supplier=Allied+Electronics
R3 R87 R94 R95 = CMP-1012-00623-3: Chip Resistor, 10 KOhm, +/- 1%, 0.1 W, -55 to 155 degC, 0603 (1608 Metric), RoHS, Tape and Reel; Manufacturer: Panasonic; Manufacturer Part Number: ERJ-3EKF1002V; Voltage Rating: 75V; Power Rating: 100mW; Temperature Coefficient: 100ppm\/degreesC; Case\/Package: 0603; Number of Pins: 2; Package Reference: 603; Depth: 0.8mm; Mount: SurfaceMount; Package Description: 2-Pin Surface Mount Device, Body 1.6 x 0.85 mm; Datasheet Version: 02/2017; Length: 1.6mm; Lead Free: LeadFree; Height: 0.45mm; Number of Terminations: 2; Max Power Dissipation: 100mW; Min Operating Temperature: -55degC; Datasheet URL: https://industrial.panasonic.com/cdbs/www-data/pdf/RDA0000/AOA0000C304.pdf; Termination: SMD/SMT; Case Code (Metric): 1608; Tolerance: 1%; Max Operating Temperature: 155degC; RoHSCompliant: true; Voltage Rating (DC): 75V; Radiation Hardening: No; Packaging: TapeandReel; Composition: ThickFilm; Mounting Technology: SurfaceMount; Manufacturer URL: http://www.panasonic.com/; Width: 0.031inch; REACH SVHC: NoSVHC; Contact Plating: Tin; Military Standard: Not; Package Quantity: 1; Supplier 1: Mouser; Supplier Part Number 1: 667-ERJ-3EKF1002V; RoHS: Yes; Category: Chip SMD Resistors; Stock 1: 20455; Pricing 1: 1=0,10000, 10=0,04000, 50=0,04000, 100=0,01700, 1000=0,00700, 5000=0,00500, 10000=0,00500 (USD); Case/Package: 0603; Size Code: 0603; Resistor Type: Thick Film; Series: ERJ; Resistance Tolerance: 1%; Construction: Rectangular; Features: Automotive AEC-Q200; Technology: THICK FILM; RoHS Compliant: Yes; ComponentLink1URL: https://datasheet.ciiva.com/16511/aoa0000ce2-16511861.pdf?src-supplier=Avnet+Asia; ComponentLink1Description: https://datasheet.ciiva.com/16511/aoa0000ce2-16511861.pdf?src-supplier=Avnet+Asia; ComponentLink2URL: https://datasheet.ciiva.com/46372/1678782-46372725.pdf?src-supplier=Element14; ComponentLink2Description: https://datasheet.ciiva.com/46372/1678782-46372725.pdf?src-supplier=Element14; ComponentLink3URL: https://datasheet.ciiva.com/28514/426256-28514198.pdf?src-supplier=Element14; ComponentLink3Description: https://datasheet.ciiva.com/28514/426256-28514198.pdf?src-supplier=Element14; ComponentLink4URL: https://datasheet.ciiva.com/9194/aoa0000ce2-9194199.pdf?src-supplier=Avnet; ComponentLink4Description: https://datasheet.ciiva.com/9194/aoa0000ce2-9194199.pdf?src-supplier=Avnet; ComponentLink5URL: https://datasheet.ciiva.com/7830/aoa0000ce2-7830729.pdf?src-supplier=Element14; ComponentLink5Description: https://datasheet.ciiva.com/7830/aoa0000ce2-7830729.pdf?src-supplier=Element14; ComponentLink6URL: https://datasheet.ciiva.com/17212/aoa0000ce2-17212105.pdf?src-supplier=Avnet+Europe; ComponentLink6Description: https://datasheet.ciiva.com/17212/aoa0000ce2-17212105.pdf?src-supplier=Avnet+Europe; ComponentLink7URL: https://datasheet.ciiva.com/30208/aoa0000ce2-30208985.pdf?src-supplier=Onlinecomponents.com; ComponentLink7Description: https://datasheet.ciiva.com/30208/aoa0000ce2-30208985.pdf?src-supplier=Onlinecomponents.com; ComponentLink8URL: https://datasheet.ciiva.com/48530/aoa0000ce2-48530988.pdf?src-supplier=Avnet; ComponentLink8Description: https://datasheet.ciiva.com/48530/aoa0000ce2-48530988.pdf?src-supplier=Avnet; ComponentLink9URL: https://datasheet.ciiva.com/24070/aoa0000ce2-24070318.pdf?src-supplier=Mouser; ComponentLink9Description: https://datasheet.ciiva.com/24070/aoa0000ce2-24070318.pdf?src-supplier=Mouser; ComponentLink10URL: https://datasheet.ciiva.com/16759/70260748-16759807.pdf?src-supplier=Allied+Electronics; ComponentLink10Description: https://datasheet.ciiva.com/16759/70260748-16759807.pdf?src-supplier=Allied+Electronics
R5 R86 R88 R91 R93 R96 R97 = CMP-2100-03667-1: Chip Resistor, 0 Ohm, +/- 5%, 0.1 W, -55 to 155 degC, 0603 (1608 Metric), RoHS, Tape and Reel; Manufacturer: Yageo; Temperature Coefficient: 200ppm/degreesC; Voltage Rating: 50V; Power Rating: 100mW; Width: 0.8mm; Max Operating Temperature: 155degC; Tolerance: 5%; Package Reference: 0603; Height: 0.45mm; Depth: 0.8mm; Package Description: 2-Pin Surface Mount Device, Body 1.6 x 0.8 mm; Termination: SMD/SMT; Package Quantity: 5000; Case/Package: 0603; Radiation Hardening: No; Number of Pins: 2; Length: 1.6mm; Lead Free: LeadFree; Voltage Rating (DC): 50V; Military Standard: Not; Datasheet URL: http://www.yageo.com/NewPortal/yageodocoutput?fileName=/pdf/R-Chip/PYu-RC_Group_51_RoHS_L_5.pdf; Manufacturer URL: http://www.yageo.com/; Packaging: TapeandReel; Case Code (Metric): 1608; Min Operating Temperature: -55degC; Composition: ThickFilm; RoHSCompliant: true; Contact Plating: Tin; Datasheet Version: Rev. 5, 10/2016; REACH SVHC: NoSVHC
  R5 R96 R97: Supplier 1: Mouser; Supplier Part Number 1: 603-RC0603JR-070RL; Manufacturer Part Number: RC0603JR-070RL; RoHS: Yes; Category: Chip SMD Resistors; Stock 1: 968392; Pricing 1: 1=0,10000, 10=0,01000, 50=0,01000, 100=0,00500, 1000=0,00400, 5000=0,00200, 10000=0,00200 (USD); Size Code: 0603; Resistor Type: Thick Film; Features: Moisture Resistant; Series: RC; Max Power Dissipation: 100mW; Number of Terminations: 2; Construction: Rectangular; Technology: THICK FILM; Resistance Tolerance: 5%; RoHS Compliant: Yes; ComponentLink1URL: https://datasheet.ciiva.com/11808/pyu-r-int-6-11808700.pdf?src-supplier=RSComponents; ComponentLink1Description: https://datasheet.ciiva.com/11808/pyu-r-int-6-11808700.pdf?src-supplier=RSComponents; ComponentLink2URL: https://datasheet.ciiva.com/22747/443971-22747530.pdf?src-supplier=Element14; ComponentLink2Description: https://datasheet.ciiva.com/22747/443971-22747530.pdf?src-supplier=Element14; ComponentLink3URL: https://datasheet.ciiva.com/12555/rc0603-272842-12555254.pdf?src-supplier=Mouser; ComponentLink3Description: https://datasheet.ciiva.com/12555/rc0603-272842-12555254.pdf?src-supplier=Mouser; ComponentLink4URL: https://datasheet.ciiva.com/7746/1738695-7746421.pdf?src-supplier=Element14; ComponentLink4Description: https://datasheet.ciiva.com/7746/1738695-7746421.pdf?src-supplier=Element14; ComponentLink5URL: https://datasheet.ciiva.com/7746/1738695-7746422.pdf?src-supplier=Element14; ComponentLink5Description: https://datasheet.ciiva.com/7746/1738695-7746422.pdf?src-supplier=Element14; ComponentLink6URL: https://datasheet.ciiva.com/8883/pyu-rc0603-51-rohs-l-4-8883045.pdf?src-supplier=Avnet; ComponentLink6Description: https://datasheet.ciiva.com/8883/pyu-rc0603-51-rohs-l-4-8883045.pdf?src-supplier=Avnet; ComponentLink7URL: https://datasheet.ciiva.com/15189/getdatasheetpartid-329462-15189845.pdf?src-supplier=Verical; ComponentLink7Description: https://datasheet.ciiva.com/15189/getdatasheetpartid-329462-15189845.pdf?src-supplier=Verical
R89 R98 R99 = CMP-2000-00317-1: Manufacturer: Panasonic; Power Rating: 100mW; Tolerance: 1%; Voltage Rating: 75V; Temperature Coefficient: 100ppm/°C; Voltage Rating (DC): 50V; Part Number: ERJ-3EKF2001V; Supplier 1: Mouser; Supplier Part Number 1: 667-ERJ-3EKF2001V; Manufacturer Part Number: ERJ-3EKF2001V; RoHS: Yes; Category: Chip SMD Resistors; Stock 1: 44455; Pricing 1: 1=0,10000, 10=0,03200, 50=0,03200, 100=0,01500, 1000=0,00700, 10000=0,00400 (USD); Mount: Surface Mount; Case/Package: 0603; Case Code (Metric): 1608; Contact Plating: Tin; Size Code: 0603; Min Operating Temperature: -55°C; Max Operating Temperature: 155°C; Packaging: Tape and Reel; Package Quantity: 1; Resistor Type: Thick Film; Number of Terminations: 2; Termination: SMD/SMT; Max Power Dissipation: 100mW; Series: ERJ; Resistance Tolerance: 1%; Construction: Rectangular; Features: Automotive AEC-Q200; Length: 1.6mm; Width: 0.031inch; Height: 0.022inch; Depth: 0.8mm; Radiation Hardening: No; REACH SVHC: No SVHC; Military Standard: Not; Lead Free: Lead Free; RoHS Compliant: Yes; ComponentLink1URL: https://datasheet.ciiva.com/43460/1678782-43460485.pdf?src-supplier=Farnell; ComponentLink1Description: https://datasheet.ciiva.com/43460/1678782-43460485.pdf?src-supplier=Farnell; ComponentLink2URL: https://datasheet.ciiva.com/6082/1678782-6082059.pdf?src-supplier=Farnell; ComponentLink2Description: https://datasheet.ciiva.com/6082/1678782-6082059.pdf?src-supplier=Farnell; ComponentLink3URL: https://datasheet.ciiva.com/46377/1678782-46377366.pdf?src-supplier=Element14; ComponentLink3Description: https://datasheet.ciiva.com/46377/1678782-46377366.pdf?src-supplier=Element14; ComponentLink4URL: https://datasheet.ciiva.com/28673/1678782-28673990.pdf?src-supplier=Element14; ComponentLink4Description: https://datasheet.ciiva.com/28673/1678782-28673990.pdf?src-supplier=Element14; ComponentLink5URL: https://datasheet.ciiva.com/24027/aoa0000ce2-24027453.pdf?src-supplier=Mouser; ComponentLink5Description: https://datasheet.ciiva.com/24027/aoa0000ce2-24027453.pdf?src-supplier=Mouser; ComponentLink6URL: https://datasheet.ciiva.com/16771/70260748-16771369.pdf?src-supplier=Allied+Electronics; ComponentLink6Description: https://datasheet.ciiva.com/16771/70260748-16771369.pdf?src-supplier=Allied+Electronics; ComponentLink7URL: https://datasheet.ciiva.com/16200/aoa0000ce2-16200501.pdf?src-supplier=Future+Electronics; ComponentLink7Description: https://datasheet.ciiva.com/16200/aoa0000ce2-16200501.pdf?src-supplier=Future+Electronics; ComponentLink8URL: https://datasheet.ciiva.com/30064/aoa0000ce2-30064920.pdf?src-supplier=Onlinecomponents.com; ComponentLink8Description: https://datasheet.ciiva.com/30064/aoa0000ce2-30064920.pdf?src-supplier=Onlinecomponents.com; ComponentLink9URL: https://datasheet.ciiva.com/17214/aoa0000ce2-17214393.pdf?src-supplier=Avnet+Europe; ComponentLink9Description: https://datasheet.ciiva.com/17214/aoa0000ce2-17214393.pdf?src-supplier=Avnet+Europe